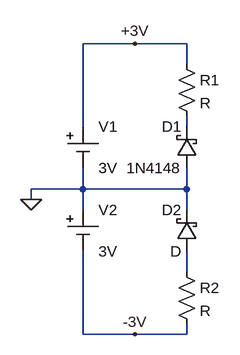
[diagram p0: schematic Draft1.asc]
Draft1.asc, the LTspice schematic file:
Version 4
SHEET 1 880 680
WIRE 64 -64 -16 -64
WIRE 144 -64 64 -64
WIRE 144 -32 144 -64
WIRE -16 64 -16 -64
WIRE 144 64 144 48
WIRE -16 160 -16 128
WIRE -16 160 -96 160
WIRE 144 160 144 128
WIRE 144 160 -16 160
WIRE -96 176 -96 160
WIRE -16 192 -16 160
WIRE 144 192 144 160
WIRE 144 288 144 256
WIRE -16 384 -16 256
WIRE 64 384 -16 384
WIRE 144 384 144 368
WIRE 144 384 64 384
FLAG -96 176 0
FLAG 64 -64 +3V
FLAG 64 384 -3V
SYMBOL Misc\\cell -16 64 R0
SYMATTR InstName V1
SYMATTR Value 3V
SYMBOL Misc\\cell -16 192 R0
SYMATTR InstName V2
SYMATTR Value 3V
SYMBOL schottky 160 128 R180
WINDOW 0 24 64 Left 2
WINDOW 3 24 0 Left 2
SYMATTR InstName D1
SYMATTR Value 1N4148
SYMBOL schottky 160 256 R180
WINDOW 0 24 64 Left 2
WINDOW 3 24 0 Left 2
SYMATTR InstName D2
SYMBOL res 128 -48 R0
SYMATTR InstName R1
SYMBOL res 128 272 R0
SYMATTR InstName R2

The netlist it stands for:
* Draft1.asc
V1 +3V 0 3V
V2 0 -3V 3V
D1 0 N001 1N4148
D2 N002 0 D
R1 +3V N001 R
R2 N002 -3V R
.model D D
.lib standard.dio
.backanno
.end